# EAGLE design linus_v1_R2 (EAGLE 7.6.0)
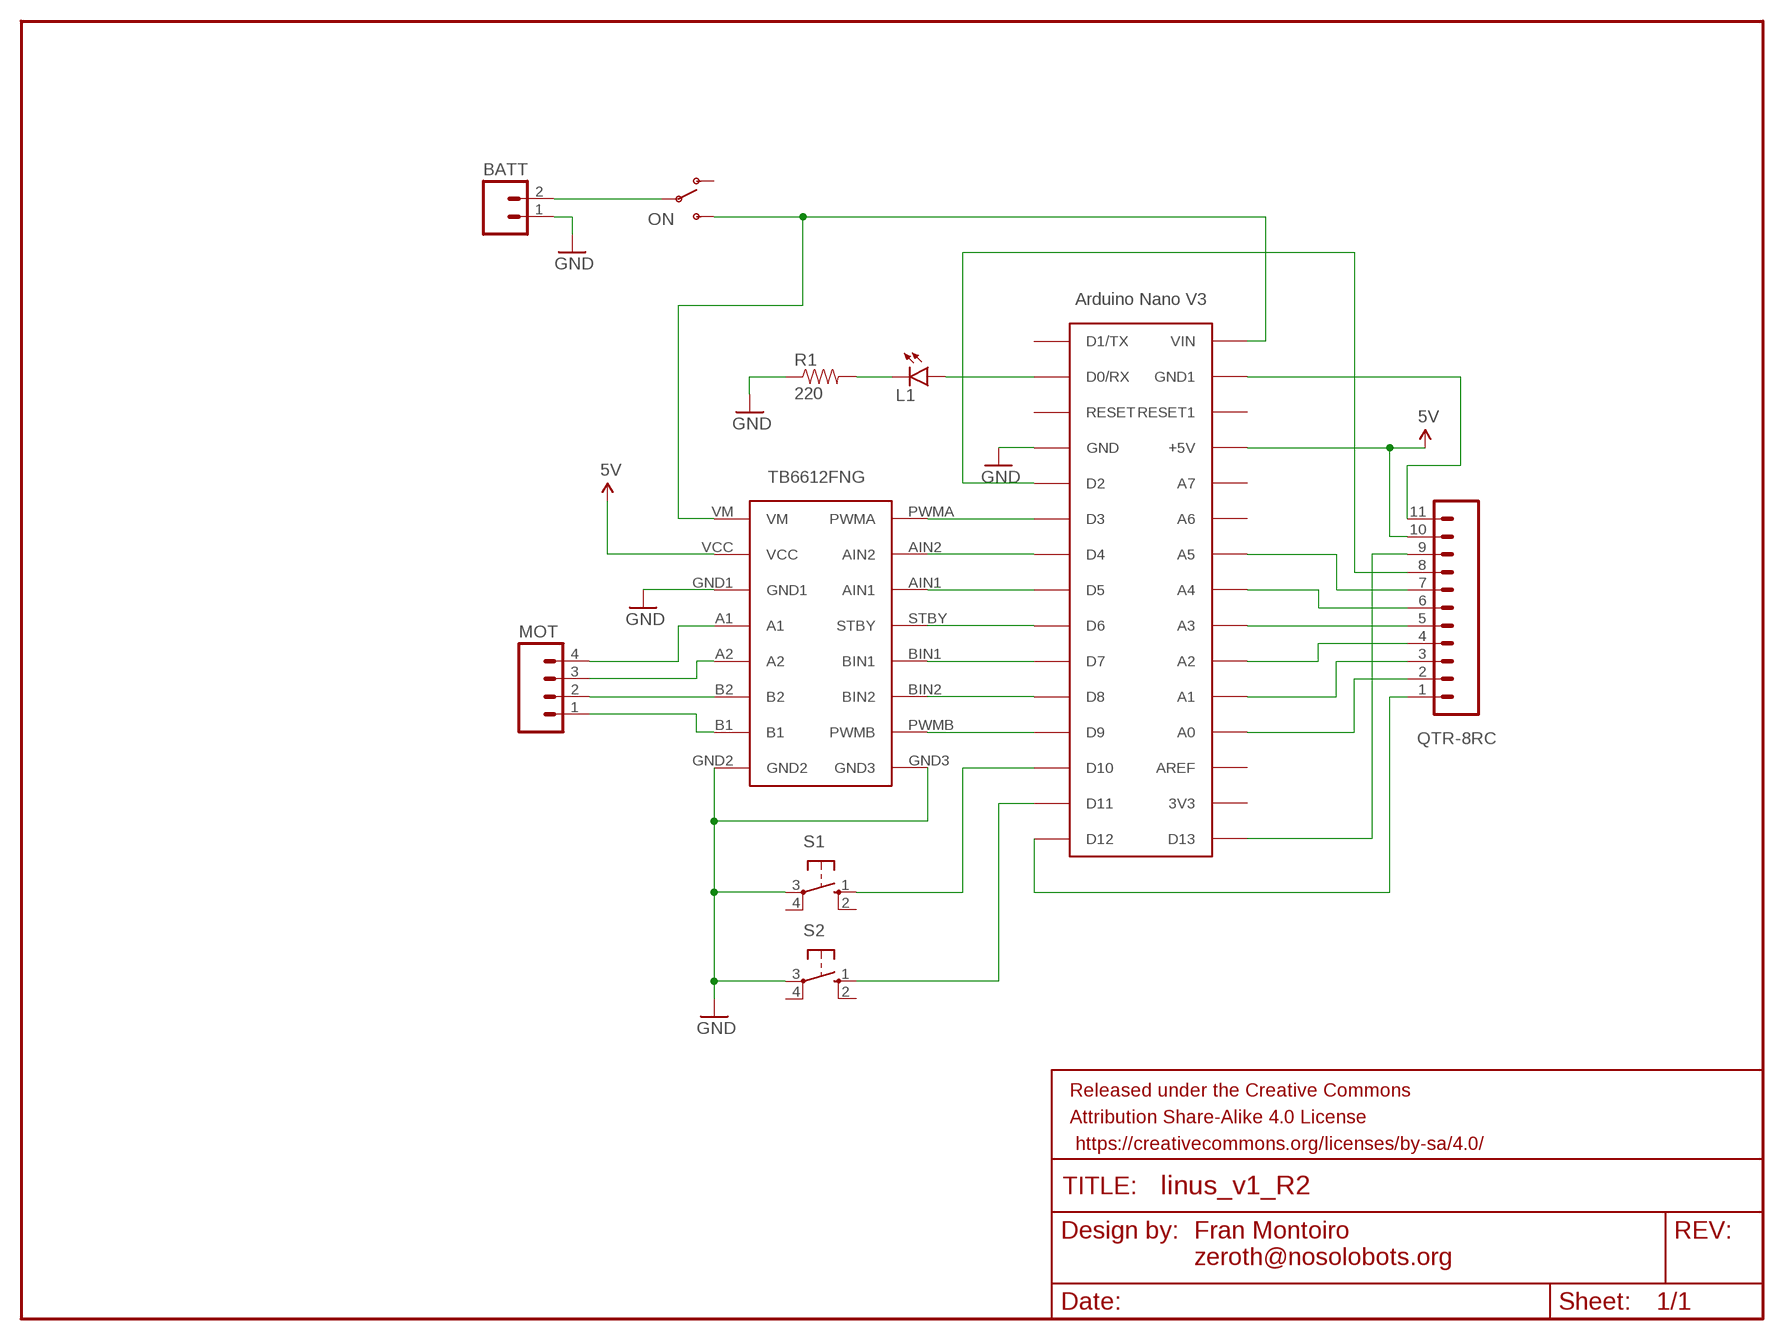
[diagram p0: schematic, sheet 1]

## Parts
BATT  M02PTH  [1X02]
FRAME1  FRAME-LETTERNO_PACKAGE  [DUMMY]
L1  LED5MM  [LED5MM]
MOT  M04PTH  [1X04]
ON  SWITCH-SPDTPTH  [SWITCH-SPDT]
QTR-8RC  M11PTH  [1X11]
R1  220  RESISTORPTH-1/4W  [AXIAL-0.4]
S1  10-XX  [B3F-10XX]
S2  10-XX  [B3F-10XX]
TB1  TB6612FNG  [TB6612FNG]
U$1  ARDUINONANO  [PDIP-32]

## Nets
5V [supply]: QTR-8RC.10 TB1.VCC U$1.+5V
GND [supply]: BATT.1 R1.P$1 S1.3(P) S2.3(P) TB1.GND1 TB1.GND2 TB1.GND3 U$1.GND
N$1 [mot]: MOT.4 TB1.A1
N$2 [mot]: MOT.3 TB1.A2
N$3 [mot]: MOT.2 TB1.B2
N$4 [mot]: MOT.1 TB1.B1
N$5: QTR-8RC.8 U$1.D2
N$6: S1.1(S) U$1.D10
N$7: S2.1(S) U$1.D11
N$8: TB1.PWMA U$1.D3
N$9: TB1.AIN2 U$1.D4
N$10: TB1.AIN1 U$1.D5
N$11: TB1.STBY U$1.D6
N$12: TB1.BIN1 U$1.D7
N$13: TB1.BIN2 U$1.D8
N$14: TB1.PWMB U$1.D9
N$15: QTR-8RC.7 U$1.A2(A5)
N$16: QTR-8RC.6 U$1.A3(A4)
N$17: QTR-8RC.5 U$1.A4(A3)
N$18: QTR-8RC.4 U$1.A5(A2)
N$19: QTR-8RC.3 U$1.A6(A1)
N$20: QTR-8RC.2 U$1.A7(A0)
N$21: QTR-8RC.1 U$1.D12
N$22 [supply]: ON.3(S) TB1.VM U$1.VIN
N$23: L1.K(C) R1.P$2
N$24: QTR-8RC.9 U$1.D13
N$25: L1.A U$1.D0/RX
N$26 [supply]: QTR-8RC.11 U$1.GND1
V+ [supply]: BATT.2 ON.2(P)
Unconnected: ON.1(O) S1.2(S1) S1.4(P1) S2.2(S1) S2.4(P1) U$1.3V3 U$1.A0(A7) U$1.A1(A6) U$1.AREF U$1.D1/TX U$1.RESET U$1.RESET1

## Notes on the sheet
- Fran Montoiro
  zeroth@nosolobots.org

## Library data of the parts
BATT = SparkFun-Connectors:M02: Standard 2-pin 0.1" header. Use with - straight break away headers ( PRT-00116) - right angle break away headers (PRT-00553) - swiss pins (PRT-00743) - machine pins (PRT-00117) - female headers (PRT-00115) Molex polarized connector foot print use with: PRT-08233 with associated crimp pins and housings. 2.54_SCREWTERM for use with PRT-10571. 3.5mm Screw Terminal footprints for PRT-08084 5mm Screw Terminal footprints for use with PRT-08432
FRAME1 = SparkFun-Aesthetics:FRAME-LETTER: Schematic Frame Standard 8.5x11 US Letter frame; DESIGNER: Nobody; VERSION: v01
L1 = SparkFun-LED:LED: LEDs Standard schematic elements and footprints for 5mm, 3mm, 1206, and 0603 sized LEDs. 5mm - Spark Fun Electronics SKU : COM-00529 (and others)
MOT = SparkFun-Connectors:M04: Header 4 Standard 4-pin 0.1" header. Use with straight break away headers (SKU : PRT-00116), right angle break away headers (PRT-00553), swiss pins (PRT-00743), machine pins (PRT-00117), and female headers (PRT-00115). Molex polarized connector foot print use with SKU : PRT-08231 with associated crimp pins and housings. 1MM SMD Version SKU: PRT-10208; PROD_ID: CONN-09696
ON = SparkFun-Electromechanical:SWITCH-SPDT: SPDT Switch Simple slide switch, Spark Fun Electronics SKU : COM-00102 DPDT SMT slide switch, AYZ0202, SWCH-08179; PROD_ID: SWCH-08261
QTR-8RC = SparkFun-Connectors:M11: Header 11 Standard 11-pin 0.1" header. Use with straight break away headers (SKU : PRT-00116), right angle break away headers (PRT-00553), swiss pins (PRT-00743), machine pins (PRT-00117), and female headers (PRT-00115).
R1 = SparkFun-Passives:RESISTOR: Resistor Basic schematic elements and footprints for 0603, 1206, and PTH resistors.
S1 S2 = switch-omron:10-XX: OMRON SWITCH; MPN: B3F-1000; OC_FARNELL: 176432; OC_NEWARK: 36M3542
TB1 = TB6612FNG:TB6612FNG
U$1 = CRE-Lib1:ARDUINONANO: Arduino Nano

## Net classes
0 default: width 0.254 mm, clearance 0.254 mm
1 supply: width 0.508 mm, clearance 0.508 mm
2 mot: width 0.508 mm

## Board
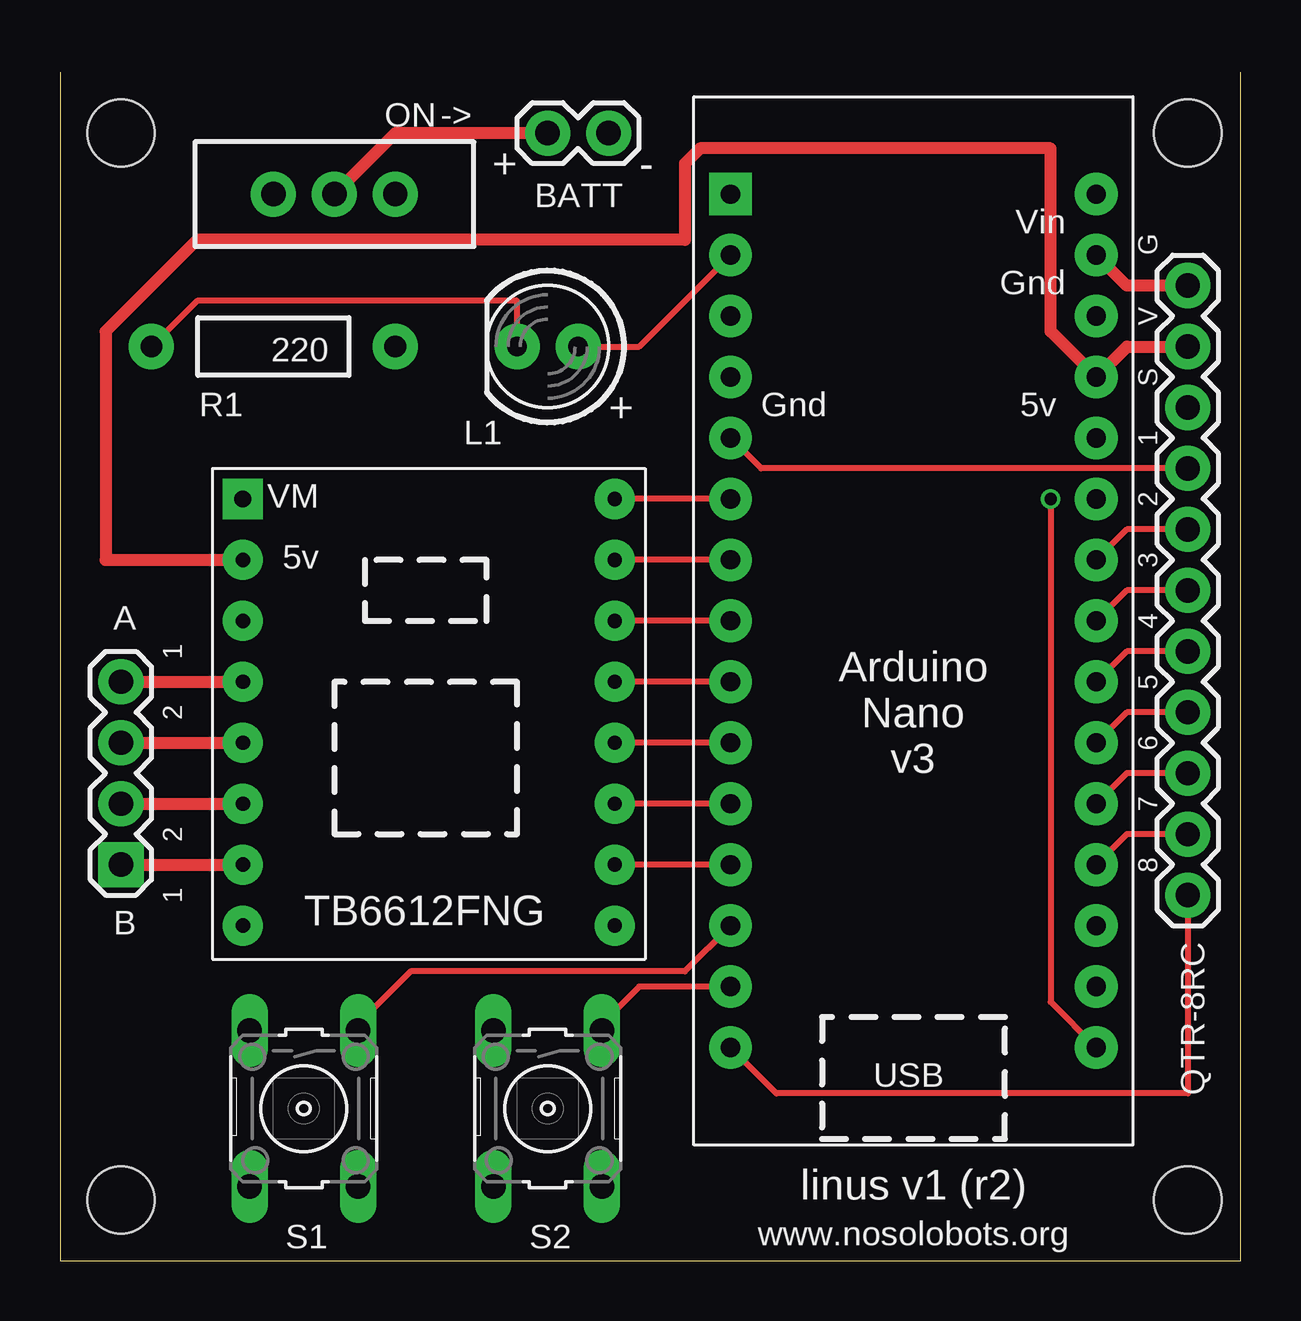
[diagram p1: board, top side]
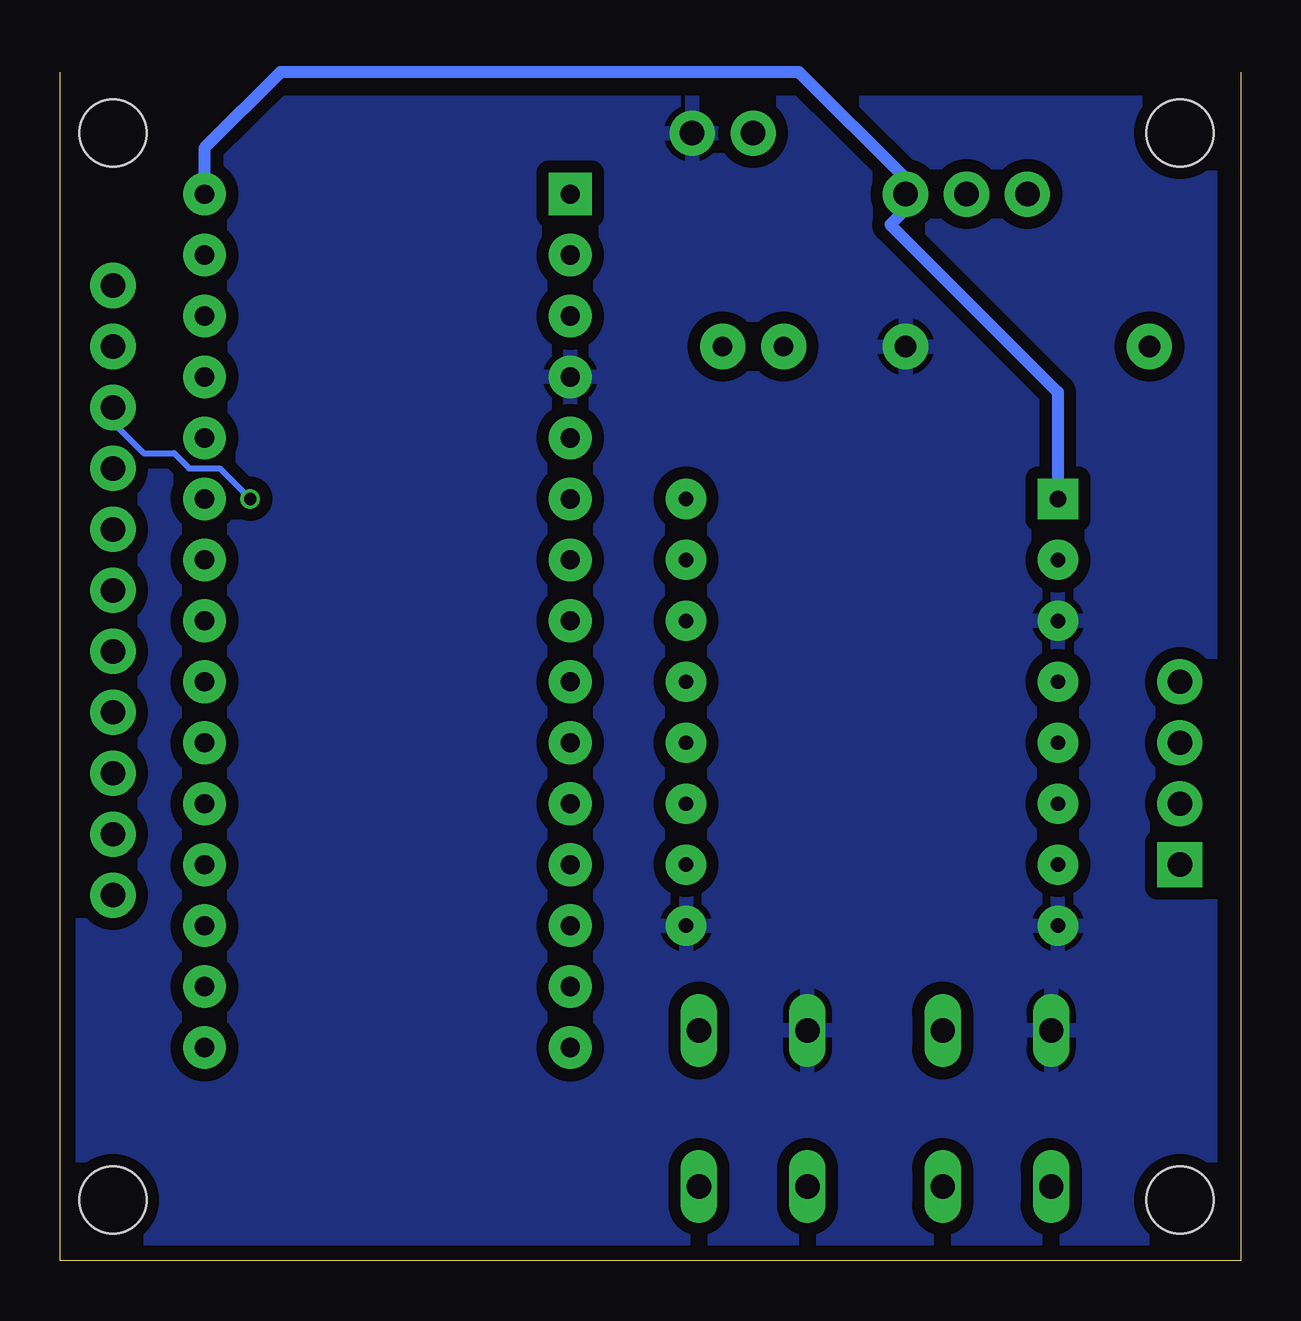
[diagram p2: board, bottom side, seen from below]

Size 49.2 x 49.52 mm. Coordinates in mm from the lower left corner, seen from the top.
Outline: 49.2,49.52 49.2,0 0,0 0,49.52
Copper layers (1*16): Top 0.035mm / dielectric 1.6mm / Bottom 0.035mm
Design rules "Elecrow_2-layer_PCB_eagle_rule": minimum track width 6mil, minimum drill 12mil, track to track 6mil, track to pad 6mil, pad to pad 6mil, via to via 8mil, smd to smd 0mil, copper to edge 20mil, drill to drill 10mil, minimum pad ring 6mil, minimum via ring 6mil, stop-mask expansion 0mil, vias tented up to drill 100mil, thermal gap 10mil
Holes 2.8 mm at 46.99,2.54 2.54,46.99 46.99,46.99 2.54,2.54

### Footprints (pad centres in the part's own frame; a part is rotated, then mirrored left to right if it is on the bottom)
1X02 = drill 1.016 pad 1.88: 1 0,0; 2 2.54,0
LED5MM = drill 0.813 pad 1.88: A -1.27,0; K 1.27,0
1X04 = drill 1.016 pad 1.88 square: 1 0,0 | drill 1.016 pad 1.88: 2 2.54,0; 3 5.08,0; 4 7.62,0
SWITCH-SPDT = drill 1.016 pad 1.88: 1 0,2.54; 2 0,0; 3 0,-2.54
1X11 = drill 1.016 pad 1.88: 1 0,0; 2 2.54,0; 3 5.08,0; 4 7.62,0; 5 10.16,0; 6 12.7,0; 7 15.24,0; 8 17.78,0; 9 20.32,0; 10 22.86,0; 11 25.4,0
AXIAL-0.4 = drill 0.9 pad 1.88: P$1 -5.08,0; P$2 5.08,0
B3F-10XX = drill 1.016 long: 1 -3.251,2.261; 2 3.251,2.261; 3 -3.251,-2.261; 4 3.251,-2.261
TB6612FNG = drill 0.6 pad 1.676: A1 -7.62,-1.27; A2 -7.62,-3.81; AIN1 7.874,1.27; AIN2 7.874,3.81; B1 -7.62,-8.89; B2 -7.62,-6.35; BIN1 7.874,-3.81; BIN2 7.874,-6.35; GND1 -7.62,1.27; GND2 -7.62,-11.43; GND3 7.874,-11.43; PWMA 7.874,6.35; PWMB 7.874,-8.89; STBY 7.874,-1.27; VCC -7.62,3.81 | drill 0.7 pad 1.676 square: VM -7.62,6.35
PDIP-32 = drill 0.8 pad 1.778: 3V3 15.24,-35.56; +5V 15.24,-10.16; A0 15.24,-12.7; A1 15.24,-15.24; A2 15.24,-17.78; A3 15.24,-20.32; A4 15.24,-22.86; A5 15.24,-25.4; A6 15.24,-27.94; A7 15.24,-30.48; AREF 15.24,-33.02; D0/RX 0,-5.08; D2 0,-12.7; D3 0,-15.24; D4 0,-17.78; D5 0,-20.32; D6 0,-22.86; D7 0,-25.4; D8 0,-27.94; D9 0,-30.48; D10 0,-33.02; D11 0,-35.56; D12 0,-38.1; D13 15.24,-38.1; GND 0,-10.16; GND1 15.24,-5.08; RESET 0,-7.62; RESET1 15.24,-7.62; VIN 15.24,-2.54 | drill 0.8 pad 1.778 square: D1/TX 0,-2.54

### Placement (x,y rotation side)
BATT  22.86,46.99 180 top
FRAME1  0,0 0 top
L1  20.32,38.1 180 top
MOT  2.54,16.51 90 top
ON  11.43,44.45 90 top
QTR-8RC  46.99,15.24 90 top
R1  8.89,38.1 180 top
S1  10.16,6.35 270 top
S2  20.32,6.35 270 top
TB1  15.24,25.4 0 top
U$1  27.94,46.99 0 top

### Tracks (layer width: path | path; a pad name or v marks a point on that pad's centre or on a via)
5V
  Top 0.508: TB1.VCC 1.91,29.21 1.91,38.73 5.71,42.55 26.04,42.55 26.04,45.72 26.67,46.35 41.27,46.35 41.27,38.73 U$1.+5V 44.45,38.1 QTR-8RC.10
GND
  pour Bottom: 1.27,48.26 1.27,0.95 48.26,0.95 48.26,48.26
N$1
  Top 0.508: MOT.4 TB1.A1
N$2
  Top 0.508: MOT.3 TB1.A2
N$3
  Top 0.508: MOT.2 TB1.B2
N$4
  Top 0.508: MOT.1 TB1.B1
N$5
  Top 0.254: U$1.D2 29.21,33.02 QTR-8RC.8
N$6
  Top 0.254: U$1.D10 26.04,12.06 14.61,12.06 12.7,10.16 S1.1
N$7
  Top 0.254: U$1.D11 24.13,11.43 22.86,10.16 S2.1
N$8
  Top 0.254: U$1.D3 TB1.PWMA
N$9
  Top 0.254: U$1.D4 TB1.AIN2
N$10
  Top 0.254: U$1.D5 TB1.AIN1
N$11
  Top 0.254: U$1.D6 TB1.STBY
N$12
  Top 0.254: U$1.D7 TB1.BIN1
N$13
  Top 0.254: U$1.D8 TB1.BIN2
N$14
  Top 0.254: U$1.D9 TB1.PWMB
N$15
  Top 0.254: U$1.A2 44.45,30.48 QTR-8RC.7
N$16
  Top 0.254: U$1.A3 44.45,27.94 QTR-8RC.6
N$17
  Top 0.254: U$1.A4 44.45,25.4 QTR-8RC.5
N$18
  Top 0.254: U$1.A5 44.45,22.86 QTR-8RC.4
N$19
  Top 0.254: U$1.A6 44.45,20.32 QTR-8RC.3
N$20
  Top 0.254: U$1.A7 44.45,17.78 QTR-8RC.2
N$21
  Top 0.254: U$1.D12 29.84,6.99 46.99,6.99 QTR-8RC.1
N$22
  Bottom 0.508: TB1.VM 7.62,36.2 14.61,43.18 13.97,43.81 ON.3 13.97,45.09 18.41,49.53 40.01,49.53 43.18,46.35 U$1.VIN
N$23
  Top 0.254: R1.P$2 5.71,40.01 19.05,40.01 L1.K
N$24  (via drill 0.51)
  Top 0.254: U$1.D13 41.27,10.79 v41.27,31.75
  Bottom 0.254: v41.27,31.75 42.55,33.02 43.81,33.02 44.45,33.66 45.72,33.66 46.99,34.92 QTR-8RC.9
N$25
  Top 0.254: U$1.D0/RX 24.13,38.1 L1.A
N$26
  Top 0.508: U$1.GND1 44.45,40.64 QTR-8RC.11
V+
  Top 0.508: ON.2 13.97,46.99 BATT.2

### Text on the board
tPlace: -> | + | - | Vin | G | Gnd | V | S | Gnd | 5v | + | 1 | VM | 2 | 5v | 3 | A | 4 | 1 | 5 | 2 | Arduino / Nano / v3 | 6 | 7 | 2 | 8 | B | 1 | USB | linus v1 (r2) | www.nosolobots.org